# Altium schematic sheet power_main.SchDoc: mcHF Pro Transceiver RF board
size A3; Author: Krassi Atanassov; CompanyName: MØNKA; Engineer: For radio amateurs experimentation, non-commercial use only. Thank you!; Revision: 0.8.2; SheetTotal: 14
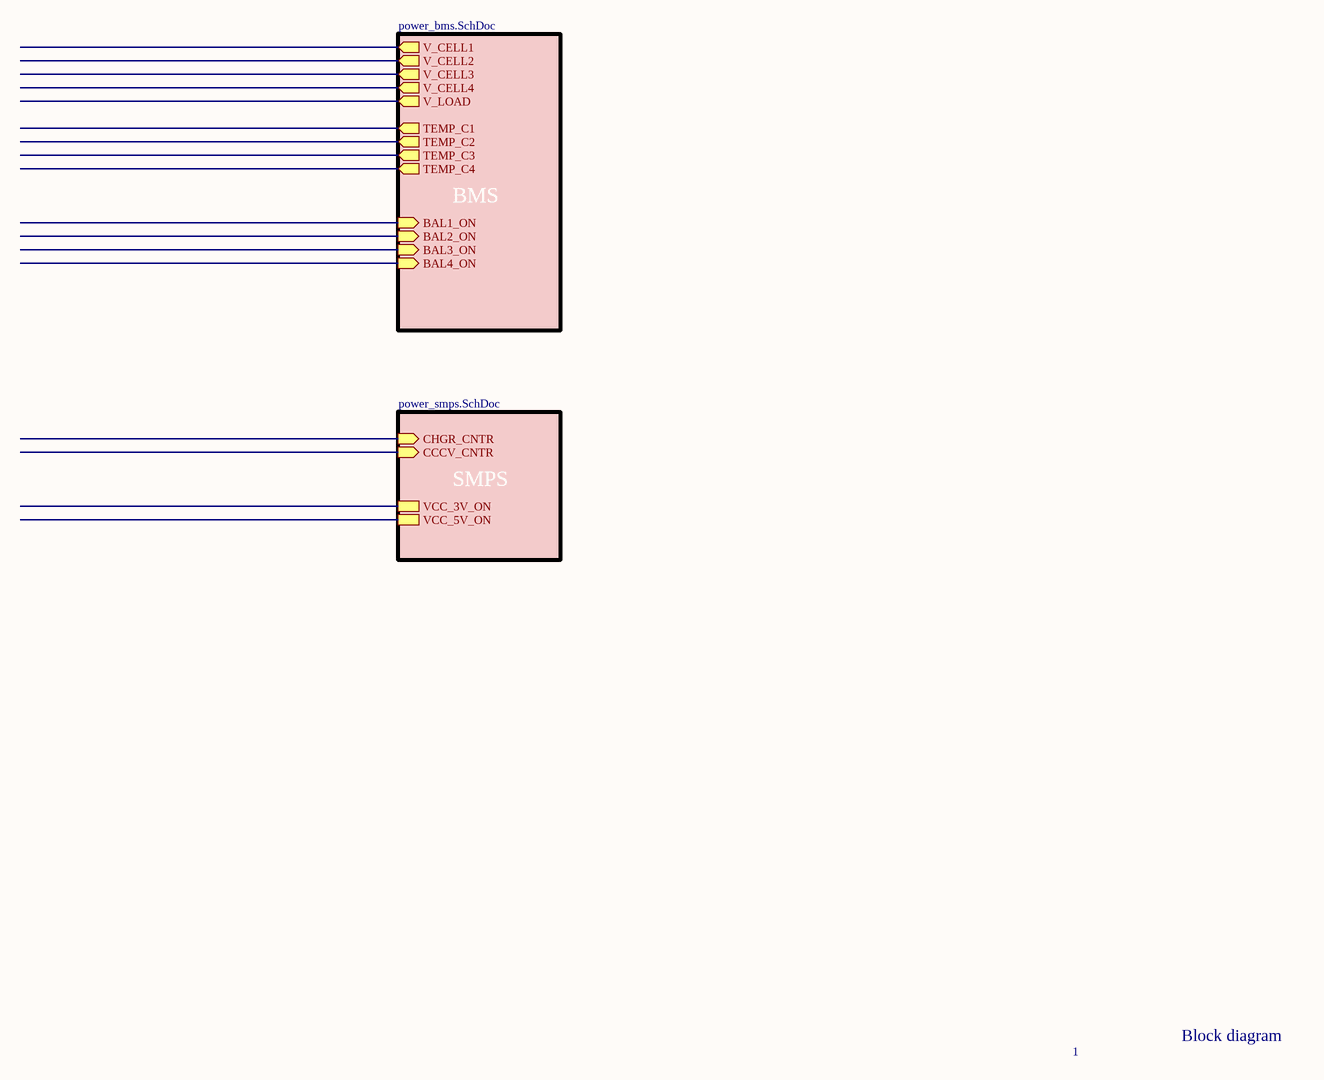
[diagram p0: power_main.SchDoc]

## Sub-sheets
BMS = power_bms.SchDoc: BAL3_ON (in), BAL2_ON (in), BAL1_ON (in), V_CELL1 (out), V_CELL2 (out), V_CELL3 (out), V_CELL4 (out), TEMP_C1 (out), TEMP_C2 (out), TEMP_C3 (out), TEMP_C4 (out), V_LOAD (out), BAL4_ON (in)
SMPS = power_smps.SchDoc: VCC_3V_ON, VCC_5V_ON, CCCV_CNTR (in), CHGR_CNTR (in)

## Notes on the sheet
- 1
- Block diagram
- Date:
- File:
- Revision:
- Sheet
- of
- Licence: